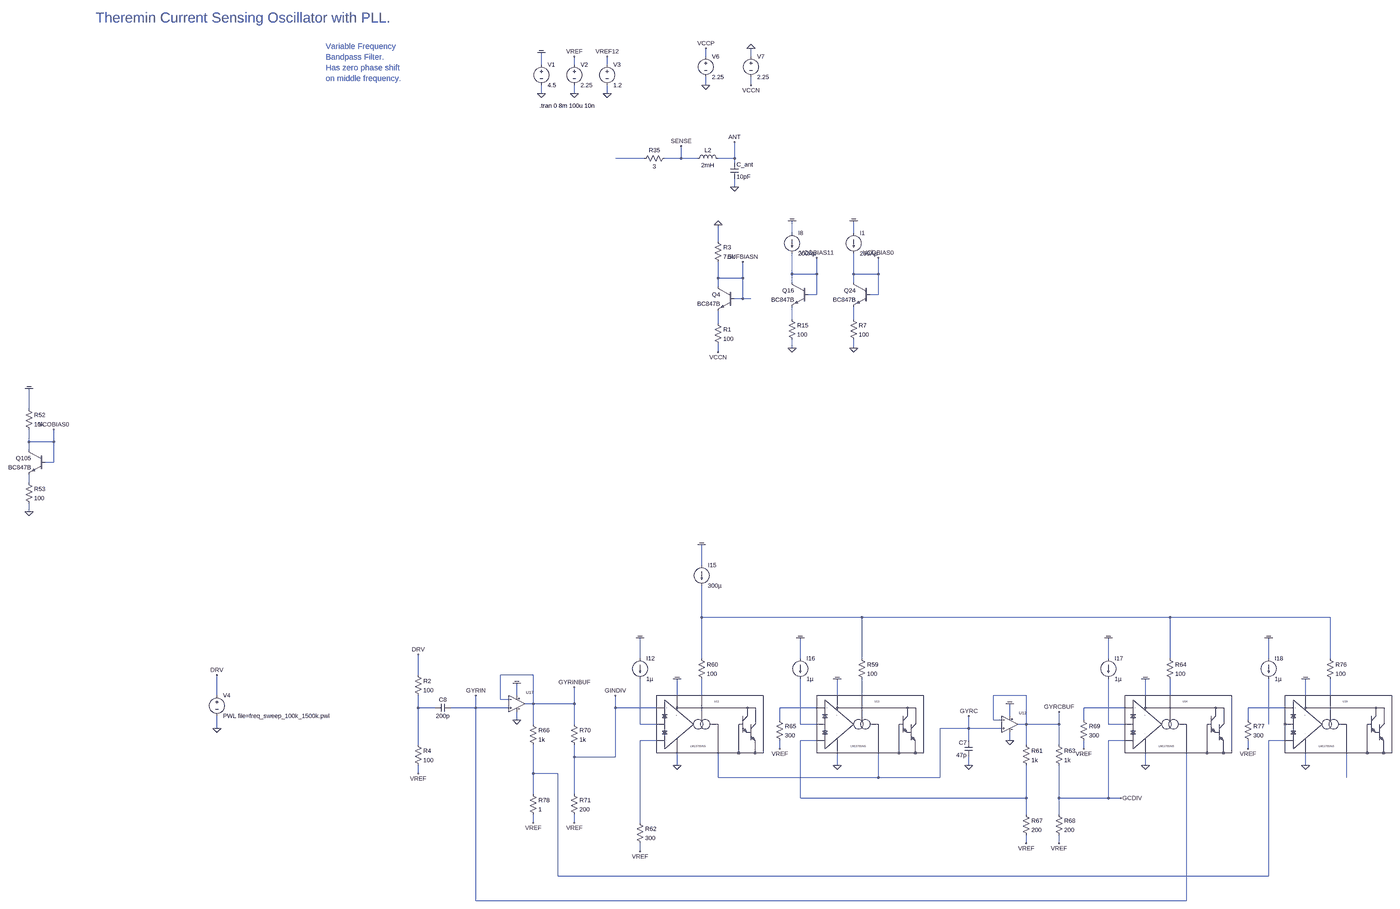
[diagram p0: schematic vco_and_lc_drive_v14.asc, whole sheet]
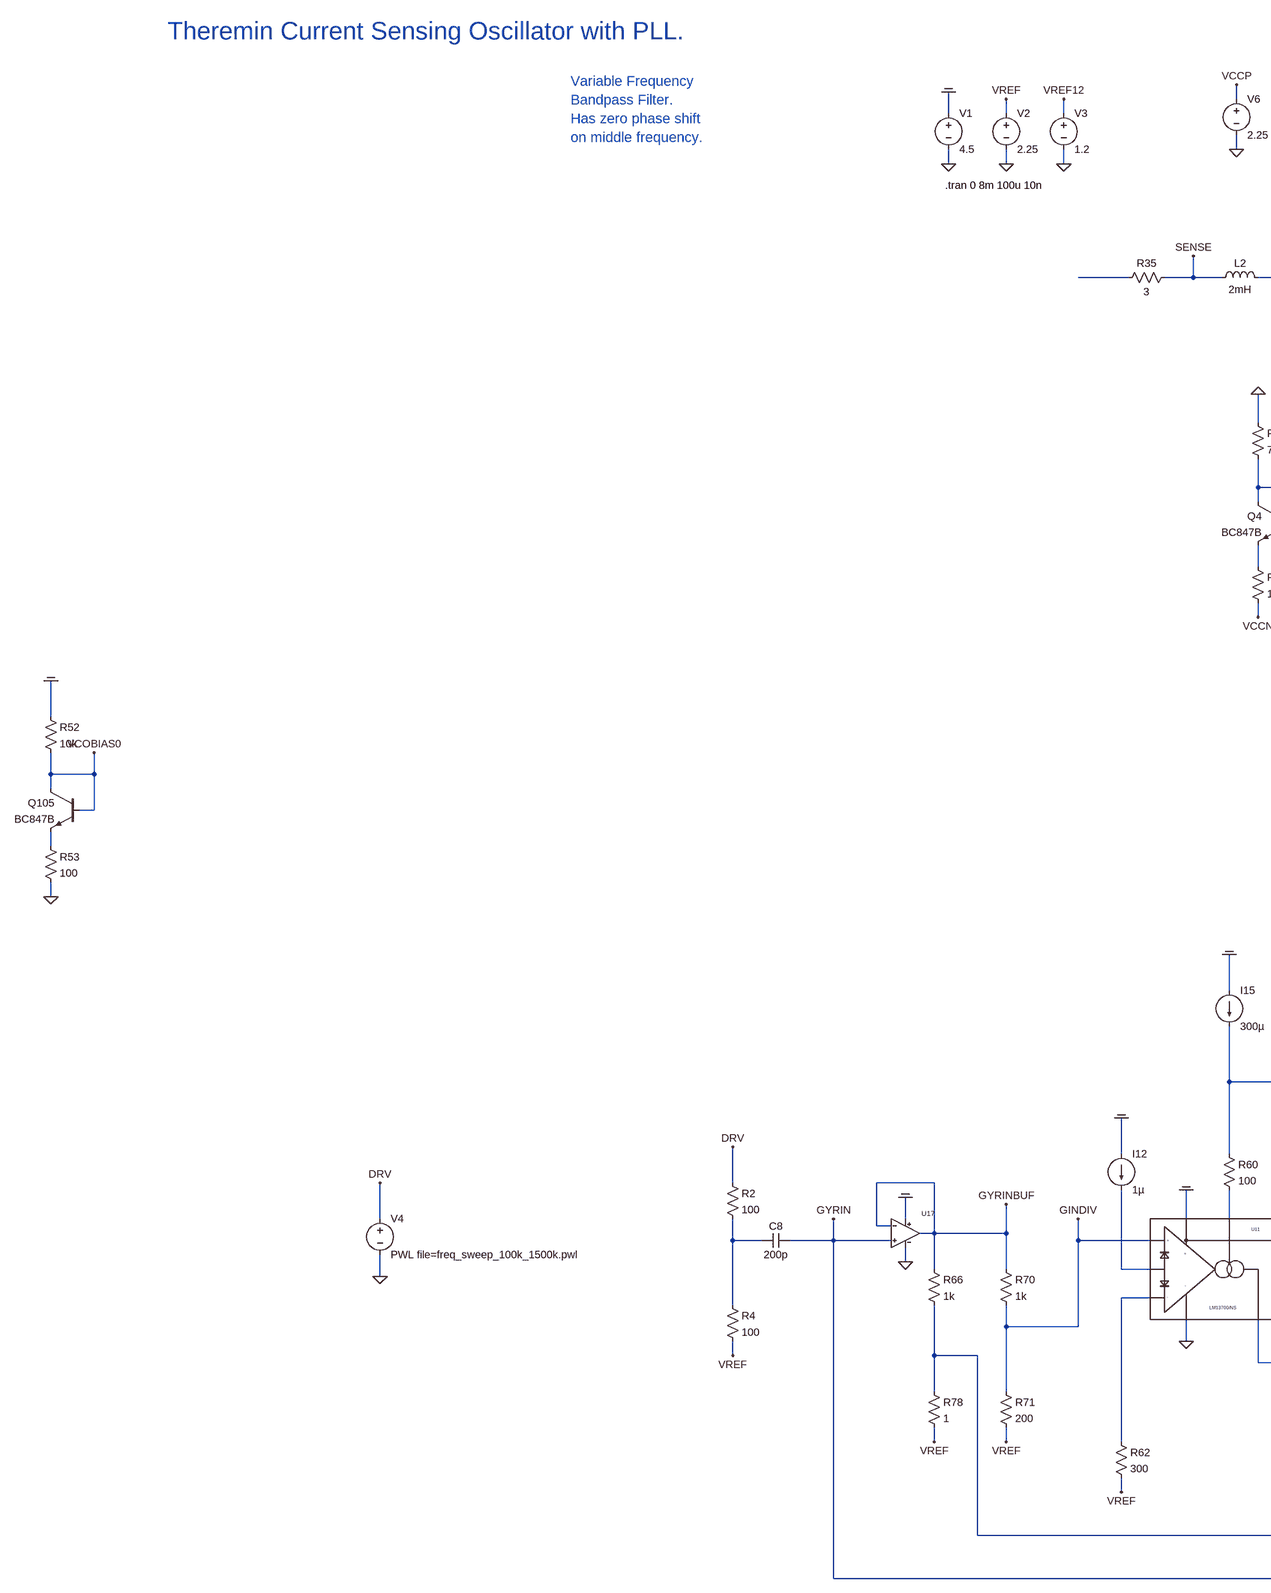
[diagram p1: schematic vco_and_lc_drive_v14.asc, part, row 1 of 1, column 1 of 2]
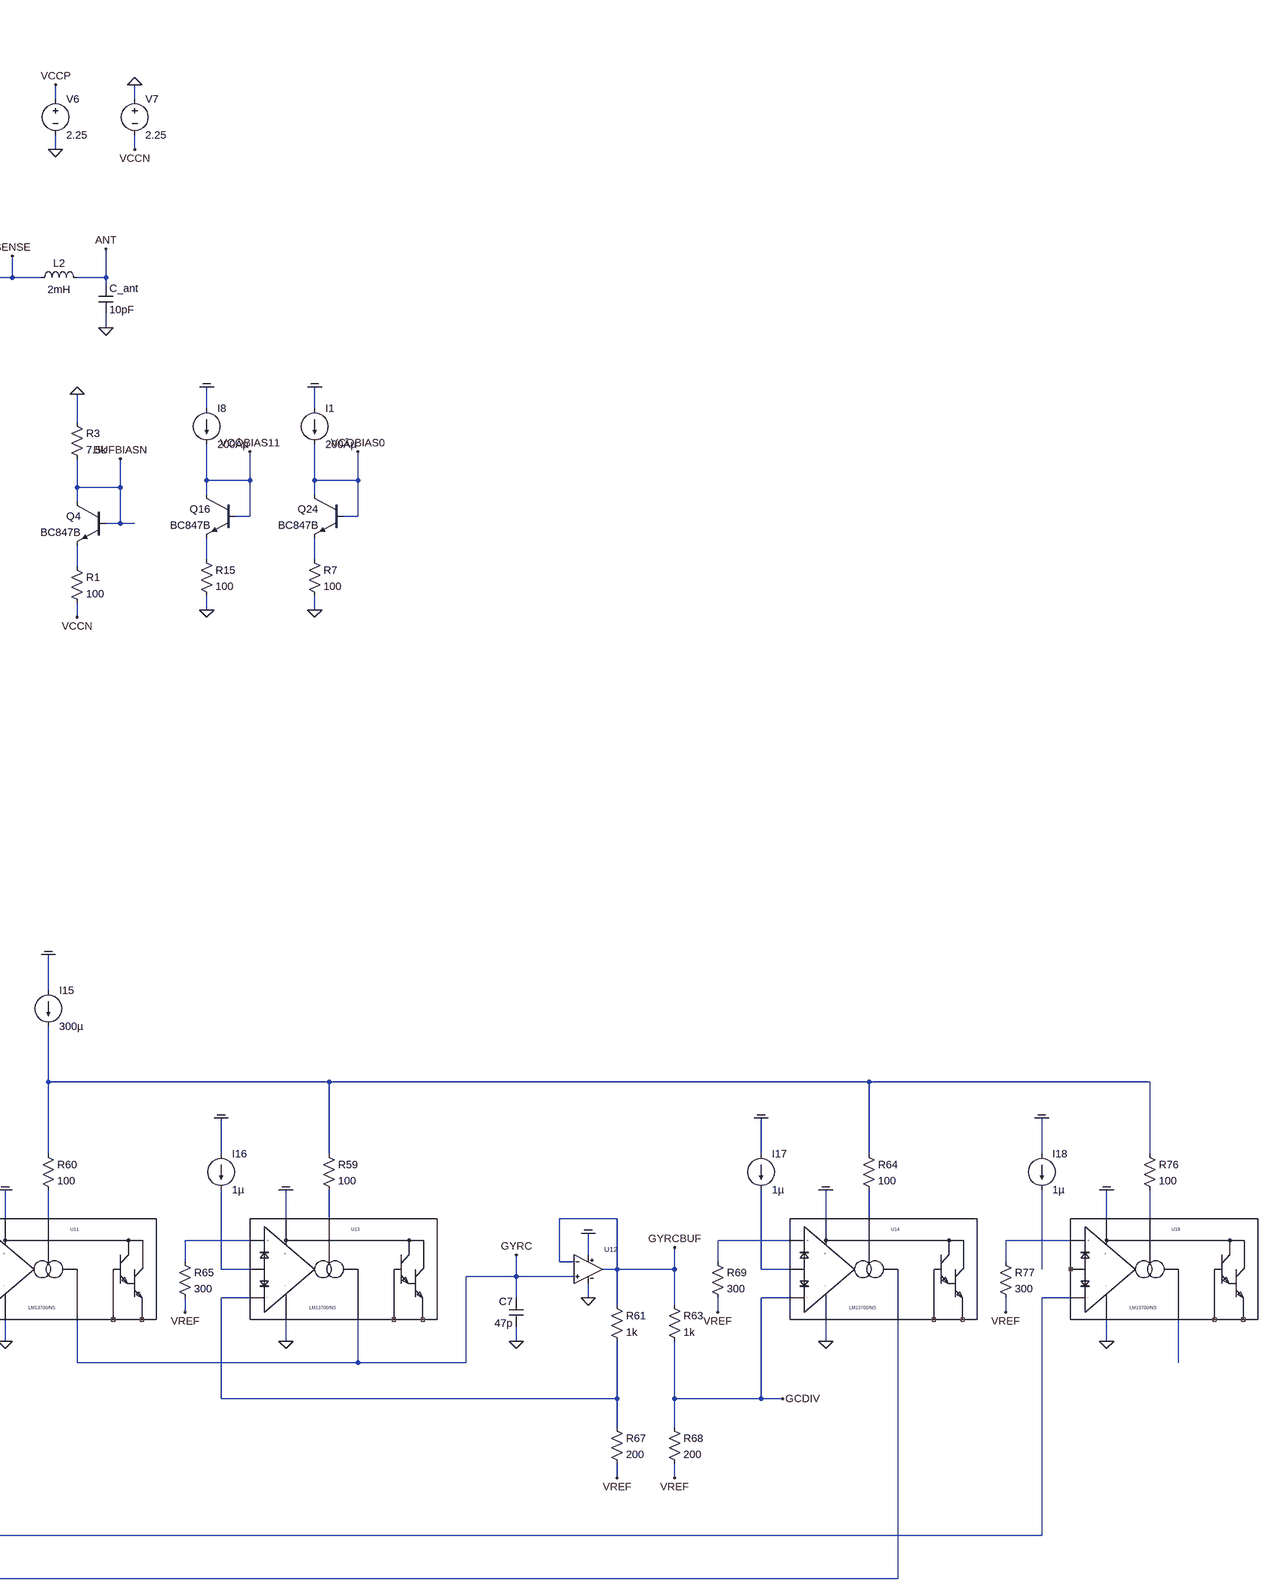
[diagram p2: schematic vco_and_lc_drive_v14.asc, part, row 1 of 1, column 2 of 2]
vco_and_lc_drive_v14.asc, the LTspice schematic file:
Version 4
SHEET 1 13504 29468
WIRE -4960 19040 -4960 19008
WIRE -4784 19040 -4784 19008
WIRE -5600 19072 -5600 19024
WIRE -5472 19072 -5472 19040
WIRE -5344 19072 -5344 19040
WIRE -4960 19152 -4960 19120
WIRE -4784 19152 -4784 19120
WIRE -5600 19184 -5600 19152
WIRE -5472 19184 -5472 19152
WIRE -5344 19184 -5344 19152
WIRE -5200 19440 -5312 19440
WIRE -5056 19440 -5056 19392
WIRE -5056 19440 -5120 19440
WIRE -4992 19440 -5056 19440
WIRE -4848 19440 -4848 19376
WIRE -4848 19440 -4912 19440
WIRE -4848 19456 -4848 19440
WIRE -4848 19552 -4848 19520
WIRE -4624 19856 -4624 19808
WIRE -4384 19856 -4384 19808
WIRE -4912 19888 -4912 19824
WIRE -4624 20016 -4624 19936
WIRE -4528 20016 -4528 19952
WIRE -4528 20016 -4624 20016
WIRE -4384 20016 -4384 19936
WIRE -4288 20016 -4288 19952
WIRE -4288 20016 -4384 20016
WIRE -4912 20032 -4912 19968
WIRE -4816 20032 -4816 19968
WIRE -4816 20032 -4912 20032
WIRE -4624 20048 -4624 20016
WIRE -4384 20048 -4384 20016
WIRE -4912 20064 -4912 20032
WIRE -4528 20096 -4528 20016
WIRE -4528 20096 -4560 20096
WIRE -4288 20096 -4288 20016
WIRE -4288 20096 -4320 20096
WIRE -4816 20112 -4816 20032
WIRE -4816 20112 -4848 20112
WIRE -4784 20112 -4816 20112
WIRE -4624 20192 -4624 20144
WIRE -4384 20192 -4384 20144
WIRE -4912 20208 -4912 20160
WIRE -4624 20304 -4624 20272
WIRE -4384 20304 -4384 20272
WIRE -4912 20320 -4912 20288
WIRE -7904 20928 -7904 20848
WIRE -7904 21056 -7904 21008
WIRE -7808 21056 -7808 21008
WIRE -7808 21056 -7904 21056
WIRE -7904 21088 -7904 21056
WIRE -7808 21136 -7808 21056
WIRE -7808 21136 -7840 21136
WIRE -7904 21216 -7904 21184
WIRE -7904 21328 -7904 21296
WIRE -4976 21632 -4976 21552
WIRE -4976 21872 -4976 21712
WIRE -4352 21872 -4976 21872
WIRE -3152 21872 -4352 21872
WIRE -2528 21872 -3152 21872
WIRE -5216 22032 -5216 21952
WIRE -4976 22032 -4976 21872
WIRE -4592 22032 -4592 21952
WIRE -4352 22032 -4352 21872
WIRE -3392 22032 -3392 21952
WIRE -3152 22032 -3152 21872
WIRE -2768 22032 -2768 21952
WIRE -2528 22032 -2528 21872
WIRE -6080 22096 -6080 22016
WIRE -5632 22096 -5760 22096
WIRE -6864 22176 -6864 22096
WIRE -5696 22176 -5696 22128
WIRE -5072 22176 -5072 22112
WIRE -4976 22176 -4976 22112
WIRE -4448 22176 -4448 22112
WIRE -4352 22176 -4352 22112
WIRE -3712 22176 -3840 22176
WIRE -3248 22176 -3248 22112
WIRE -3152 22176 -3152 22112
WIRE -2624 22176 -2624 22112
WIRE -2528 22176 -2528 22112
WIRE -5760 22192 -5760 22096
WIRE -5728 22192 -5760 22192
WIRE -5632 22208 -5632 22096
WIRE -5632 22208 -5664 22208
WIRE -5472 22208 -5472 22144
WIRE -5472 22208 -5632 22208
WIRE -6080 22224 -6080 22176
WIRE -6016 22224 -6080 22224
WIRE -5856 22224 -5856 22176
WIRE -5856 22224 -5952 22224
WIRE -5728 22224 -5856 22224
WIRE -5312 22224 -5312 22176
WIRE -5152 22224 -5312 22224
WIRE -4528 22224 -4672 22224
WIRE -3328 22224 -3488 22224
WIRE -2704 22224 -2848 22224
WIRE -3776 22256 -3776 22208
WIRE -5696 22272 -5696 22240
WIRE -4672 22272 -4672 22224
WIRE -3840 22272 -3840 22176
WIRE -3808 22272 -3840 22272
WIRE -3488 22272 -3488 22224
WIRE -2848 22272 -2848 22224
WIRE -5632 22288 -5632 22208
WIRE -5472 22288 -5472 22208
WIRE -5216 22288 -5216 22112
WIRE -5152 22288 -5216 22288
WIRE -4592 22288 -4592 22112
WIRE -4528 22288 -4592 22288
WIRE -3712 22288 -3712 22176
WIRE -3712 22288 -3744 22288
WIRE -3584 22288 -3584 22240
WIRE -3584 22288 -3712 22288
WIRE -3392 22288 -3392 22112
WIRE -3328 22288 -3392 22288
WIRE -2768 22288 -2768 22112
WIRE -6864 22304 -6864 22256
WIRE -3936 22304 -3936 22256
WIRE -3936 22304 -4048 22304
WIRE -3808 22304 -3936 22304
WIRE -5152 22352 -5216 22352
WIRE -4528 22352 -4592 22352
WIRE -3936 22352 -3936 22304
WIRE -3776 22352 -3776 22320
WIRE -3328 22352 -3392 22352
WIRE -2704 22352 -2768 22352
WIRE -6080 22368 -6080 22224
WIRE -3712 22368 -3712 22288
WIRE -3584 22368 -3584 22288
WIRE -4672 22384 -4672 22352
WIRE -3488 22384 -3488 22352
WIRE -2848 22384 -2848 22352
WIRE -5472 22416 -5472 22368
WIRE -5312 22416 -5312 22224
WIRE -5312 22416 -5472 22416
WIRE -5072 22448 -5072 22400
WIRE -4448 22448 -4448 22400
WIRE -3936 22448 -3936 22416
WIRE -3248 22448 -3248 22400
WIRE -2624 22448 -2624 22400
WIRE -6080 22480 -6080 22448
WIRE -5632 22480 -5632 22368
WIRE -5536 22480 -5632 22480
WIRE -4912 22496 -4912 22400
WIRE -4288 22496 -4288 22400
WIRE -4288 22496 -4912 22496
WIRE -4048 22496 -4048 22304
WIRE -4048 22496 -4288 22496
WIRE -2464 22496 -2464 22400
WIRE -5632 22560 -5632 22480
WIRE -5472 22560 -5472 22416
WIRE -4592 22576 -4592 22352
WIRE -3712 22576 -3712 22448
WIRE -3712 22576 -4592 22576
WIRE -3584 22576 -3584 22448
WIRE -3392 22576 -3392 22352
WIRE -3392 22576 -3584 22576
WIRE -3344 22576 -3392 22576
WIRE -3712 22640 -3712 22576
WIRE -3584 22640 -3584 22576
WIRE -5632 22672 -5632 22640
WIRE -5472 22672 -5472 22640
WIRE -5216 22672 -5216 22352
WIRE -3712 22752 -3712 22720
WIRE -3584 22752 -3584 22720
WIRE -5216 22784 -5216 22752
WIRE -5536 22880 -5536 22480
WIRE -2768 22880 -2768 22352
WIRE -2768 22880 -5536 22880
WIRE -5856 22976 -5856 22224
WIRE -3088 22976 -3088 22400
WIRE -3088 22976 -5856 22976
FLAG -5600 19184 0
FLAG -5600 19024 COM
FLAG -5472 19184 0
FLAG -5472 19040 VREF
FLAG -4848 19376 ANT
FLAG -5056 19392 SENSE
FLAG -5344 19184 0
FLAG -5344 19040 VREF12
FLAG -7904 20848 COM
FLAG -7904 21328 0
FLAG -7808 21008 VCOBIAS0
FLAG -4960 19152 0
FLAG -4960 19008 VCCP
FLAG -4784 19008 0
FLAG -4784 19152 VCCN
FLAG -4912 20320 VCCN
FLAG -4912 19824 0
FLAG -4816 19968 BUFBIASN
FLAG -4848 19552 0
FLAG -4624 20304 0
FLAG -4528 19952 VCOBIAS11
FLAG -4624 19808 COM
FLAG -4384 20304 0
FLAG -4288 19952 VCOBIAS0
FLAG -4384 19808 COM
FLAG -6864 22304 0
FLAG -6864 22096 DRV
FLAG -5072 22448 0
FLAG -5072 22112 COM
FLAG -5216 21952 COM
FLAG -3936 22448 0
FLAG -3936 22256 GYRC
FLAG -4976 21552 COM
FLAG -5216 22784 VREF
FLAG -3776 22352 0
FLAG -3776 22208 COM
FLAG -4448 22448 0
FLAG -4448 22112 COM
FLAG -4592 21952 COM
FLAG -4672 22384 VREF
FLAG -3712 22752 VREF
FLAG -6080 22016 DRV
FLAG -3248 22448 0
FLAG -3248 22112 COM
FLAG -3392 21952 COM
FLAG -3488 22384 VREF
FLAG -5696 22272 0
FLAG -5696 22128 COM
FLAG -2624 22448 0
FLAG -2624 22112 COM
FLAG -2768 21952 COM
FLAG -2848 22384 VREF
FLAG -5632 22672 VREF
FLAG -3584 22752 VREF
FLAG -5472 22672 VREF
FLAG -5856 22176 GYRIN
FLAG -5472 22144 GYRINBUF
FLAG -3584 22240 GYRCBUF
FLAG -3344 22576 GCDIV
FLAG -5312 22176 GINDIV
FLAG -6080 22480 VREF
SYMBOL voltage -5600 19056 R0
SYMATTR InstName V1
SYMATTR Value 4.5
SYMBOL Voltage -5472 19056 R0
SYMATTR InstName V2
SYMATTR Value 2.25
SYMBOL ind -5008 19456 R270
WINDOW 0 32 56 VTop 2
WINDOW 3 5 56 VBottom 2
SYMATTR InstName L2
SYMATTR Value 2mH
SYMATTR SpiceLine Rser=120 Cpar=1pF
SYMBOL Cap -4864 19456 R0
SYMATTR InstName C_ant
SYMATTR Value 10pF
SYMBOL Res -5216 19456 R270
WINDOW 0 32 56 VTop 2
WINDOW 3 0 56 VBottom 2
SYMATTR InstName R35
SYMATTR Value 3
SYMBOL Voltage -5344 19056 R0
SYMATTR InstName V3
SYMATTR Value 1.2
SYMBOL npn -7840 21088 M0
SYMATTR InstName Q105
SYMATTR Value BC847B
SYMBOL Res -7920 20912 R0
SYMATTR InstName R52
SYMATTR Value 10k
SYMBOL Res -7920 21200 R0
SYMATTR InstName R53
SYMATTR Value 100
SYMBOL Voltage -4960 19024 R0
SYMATTR InstName V6
SYMATTR Value 2.25
SYMBOL Voltage -4784 19024 R0
SYMATTR InstName V7
SYMATTR Value 2.25
SYMBOL npn -4848 20064 M0
SYMATTR InstName Q4
SYMATTR Value BC847B
SYMBOL Res -4928 20192 R0
SYMATTR InstName R1
SYMATTR Value 100
SYMBOL Res -4928 19872 R0
SYMATTR InstName R3
SYMATTR Value 7.5k
SYMBOL npn -4560 20048 M0
SYMATTR InstName Q16
SYMATTR Value BC847B
SYMBOL Res -4640 20176 R0
SYMATTR InstName R15
SYMATTR Value 100
SYMBOL current -4624 19856 R0
SYMATTR InstName I8
SYMATTR Value 200Âµ
SYMBOL npn -4320 20048 M0
SYMATTR InstName Q24
SYMATTR Value BC847B
SYMBOL Res -4400 20176 R0
SYMATTR InstName R7
SYMATTR Value 100
SYMBOL current -4384 19856 R0
SYMATTR InstName I1
SYMATTR Value 200Âµ
SYMBOL Voltage -6864 22160 R0
SYMATTR InstName V4
SYMATTR Value PWL file=freq_sweep_100k_1500k.pwl
SYMBOL LM13700 -5072 22288 R0
SYMATTR InstName U11
SYMBOL current -5216 22032 R0
SYMATTR InstName I12
SYMATTR Value 1µ
SYMBOL Cap -3920 22416 R180
WINDOW 0 24 56 Left 2
WINDOW 3 24 8 Left 2
SYMATTR InstName C7
SYMATTR Value 47p
SYMBOL Res -4992 22016 R0
SYMATTR InstName R60
SYMATTR Value 100
SYMBOL Res -3728 22352 R0
SYMATTR InstName R61
SYMATTR Value 1k
SYMBOL current -4976 21632 R0
SYMATTR InstName I15
SYMATTR Value 300µ
SYMBOL Res -5232 22656 R0
SYMATTR InstName R62
SYMATTR Value 300
SYMBOL MCP6021 -3776 22288 R0
SYMATTR InstName U12
SYMBOL LM13700 -4448 22288 R0
SYMATTR InstName U13
SYMBOL current -4592 22032 R0
SYMATTR InstName I16
SYMATTR Value 1µ
SYMBOL Res -4368 22016 R0
SYMATTR InstName R59
SYMATTR Value 100
SYMBOL Res -4688 22256 R0
SYMATTR InstName R65
SYMATTR Value 300
SYMBOL Res -3728 22624 R0
SYMATTR InstName R67
SYMATTR Value 200
SYMBOL LM13700 -3248 22288 R0
SYMATTR InstName U14
SYMBOL current -3392 22032 R0
SYMATTR InstName I17
SYMATTR Value 1µ
SYMBOL Res -3168 22016 R0
SYMATTR InstName R64
SYMATTR Value 100
SYMBOL Res -5648 22272 R0
SYMATTR InstName R66
SYMATTR Value 1k
SYMBOL Res -3504 22256 R0
SYMATTR InstName R69
SYMATTR Value 300
SYMBOL MCP6021 -5696 22208 R0
SYMATTR InstName U17
SYMBOL LM13700 -2624 22288 R0
SYMATTR InstName U19
SYMBOL current -2768 22032 R0
SYMATTR InstName I18
SYMATTR Value 1µ
SYMBOL Res -2544 22016 R0
SYMATTR InstName R76
SYMATTR Value 100
SYMBOL Res -2864 22256 R0
SYMATTR InstName R77
SYMATTR Value 300
SYMBOL Res -5648 22544 R0
SYMATTR InstName R78
SYMATTR Value 1
SYMBOL Res -3600 22352 R0
SYMATTR InstName R63
SYMATTR Value 1k
SYMBOL Res -3600 22624 R0
SYMATTR InstName R68
SYMATTR Value 200
SYMBOL Res -5488 22272 R0
SYMATTR InstName R70
SYMATTR Value 1k
SYMBOL Res -5488 22544 R0
SYMATTR InstName R71
SYMATTR Value 200
SYMBOL Cap -5952 22208 R90
WINDOW 0 0 32 VBottom 2
WINDOW 3 32 32 VTop 2
SYMATTR InstName C8
SYMATTR Value 200p
SYMBOL Res -6096 22080 R0
SYMATTR InstName R2
SYMATTR Value 100
SYMBOL Res -6096 22352 R0
SYMATTR InstName R4
SYMATTR Value 100
TEXT -5608 19232 Left 2 !.tran 0 8m 100u 10n
TEXT -7336 18888 Left 5 ;Theremin Current Sensing Oscillator with PLL.
TEXT -6440 19000 Left 3 ;Variable Frequency \nBandpass Filter.\nHas zero phase shift \non middle frequency.

The netlist it stands for:
* vco_and_lc_drive_v14.asc
V1 COM 0 4.5
V2 VREF 0 2.25
L2 SENSE ANT 2mH Rser=120 Cpar=1pF
C_ant ANT 0 10pF
R35 N001 SENSE 3
V3 VREF12 0 1.2
Q105 VCOBIAS0 VCOBIAS0 N005 0 BC847B
R52 COM VCOBIAS0 10k
R53 N005 0 100
V6 VCCP 0 2.25
V7 0 VCCN 2.25
Q4 BUFBIASN BUFBIASN N004 0 BC847B
R1 N004 VCCN 100
R3 0 BUFBIASN 7.5k
Q16 VCOBIAS11 VCOBIAS11 N002 0 BC847B
R15 N002 0 100
I8 COM VCOBIAS11 200Âµ
Q24 VCOBIAS0 VCOBIAS0 N003 0 BC847B
R7 N003 0 100
I1 COM VCOBIAS0 200Âµ
V4 DRV 0 PWL file=freq_sweep_100k_1500k.pwl
XU11 N007 N015 GINDIV N019 GYRC 0 NC_01 NC_02 COM LM13700/NS  ; pins Ibias Dio_bias in+ in- out V- buf_in buf_out V+
I12 COM N015 1µ
C7 0 GYRC 47p
R60 N006 N007 100
R61 GYRCBUF N020 1k
I15 COM N006 300µ
R62 N019 VREF 300
XU12 GYRC GYRCBUF COM 0 GYRCBUF MCP6021  ; pins In+ In- V+ V- OUT
XU13 N008 N016 N012 N020 GYRC 0 NC_03 NC_04 COM LM13700/NS  ; pins Ibias Dio_bias in+ in- out V- buf_in buf_out V+
I16 COM N016 1µ
R59 N006 N008 100
R65 N012 VREF 300
R67 N020 VREF 200
XU14 N009 N017 N013 GCDIV GYRIN 0 NC_05 NC_06 COM LM13700/NS  ; pins Ibias Dio_bias in+ in- out V- buf_in buf_out V+
I17 COM N017 1µ
R64 N006 N009 100
R66 GYRINBUF N021 1k
R69 N013 VREF 300
XU17 GYRIN GYRINBUF COM 0 GYRINBUF MCP6021  ; pins In+ In- V+ V- OUT
XU19 N010 NC_07 N014 N021 N022 0 NC_08 NC_09 COM LM13700/NS  ; pins Ibias Dio_bias in+ in- out V- buf_in buf_out V+
I18 COM N018 1µ
R76 N006 N010 100
R77 N014 VREF 300
R78 N021 VREF 1
R63 GYRCBUF GCDIV 1k
R68 GCDIV VREF 200
R70 GYRINBUF GINDIV 1k
R71 GINDIV VREF 200
C8 GYRIN N011 200p
R2 DRV N011 100
R4 N011 VREF 100
.model NPN NPN
.model PNP PNP
.lib standard.bjt
.tran 0 8m 100u 10n
* Theremin Current Sensing Oscillator with PLL.
* Variable Frequency
* Bandpass Filter.
* Has zero phase shift
* on middle frequency.
.lib ns_models.lib
.lib MCP6021.cir
.backanno
.end